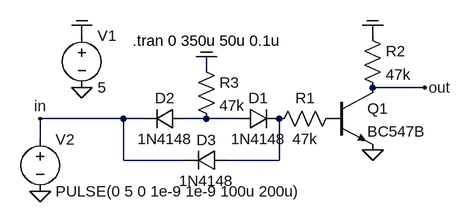
[diagram p0: schematic dtl3.asc]
dtl3.asc, the LTspice schematic file:
Version 4
SHEET 1 880 680
WIRE -16 -16 -16 -32
WIRE 432 -16 432 -32
WIRE 176 32 176 16
WIRE 512 64 432 64
WIRE 48 112 -80 112
WIRE 80 112 48 112
WIRE 176 112 144 112
WIRE 224 112 176 112
WIRE -80 144 -80 112
WIRE 48 176 48 112
WIRE 144 176 48 176
WIRE 288 176 288 112
WIRE 288 176 208 176
FLAG -16 64 0
FLAG -16 -32 COM
FLAG 432 160 0
FLAG -80 224 0
FLAG 432 -32 COM
FLAG 512 64 out
FLAG -80 112 in
FLAG 176 16 COM
SYMBOL voltage -16 -32 R0
WINDOW 123 0 0 Left 2
WINDOW 39 0 0 Left 2
SYMATTR InstName V1
SYMATTR Value 5
SYMBOL diode 224 128 R270
WINDOW 0 32 32 VTop 2
WINDOW 3 0 32 VBottom 2
SYMATTR InstName D1
SYMATTR Value 1N4148
SYMBOL res 384 96 R90
WINDOW 0 0 56 VBottom 2
WINDOW 3 32 56 VTop 2
SYMATTR InstName R1
SYMATTR Value 47k
SYMBOL npn 368 64 R0
SYMATTR InstName Q1
SYMATTR Value BC547B
SYMBOL res 416 -32 R0
SYMATTR InstName R2
SYMATTR Value 47k
SYMBOL voltage -80 128 R0
WINDOW 123 0 0 Left 2
WINDOW 39 0 0 Left 2
SYMATTR InstName V2
SYMATTR Value PULSE(0 5 0 1e-9 1e-9 100u 200u)
SYMBOL diode 144 96 R90
WINDOW 0 0 32 VBottom 2
WINDOW 3 32 32 VTop 2
SYMATTR InstName D2
SYMATTR Value 1N4148
SYMBOL res 160 16 R0
SYMATTR InstName R3
SYMATTR Value 47k
SYMBOL diode 208 160 R90
WINDOW 0 0 32 VBottom 2
WINDOW 3 32 32 VTop 2
SYMATTR InstName D3
SYMATTR Value 1N4148
TEXT 62 -8 Left 2 !.tran 0 350u 50u 0.1u

The netlist it stands for:
* dtl3.asc
V1 COM 0 5
D1 N001 N002 1N4148
R1 P001 N002 47k
Q1 out P001 0 0 BC547B
R2 COM out 47k
V2 in 0 PULSE(0 5 0 1e-9 1e-9 100u 200u)
D2 N001 in 1N4148
R3 COM N001 47k
D3 N002 in 1N4148
.model D D
.lib standard.dio
.model NPN NPN
.model PNP PNP
.lib standard.bjt
.tran 0 350u 50u 0.1u
.backanno
.end